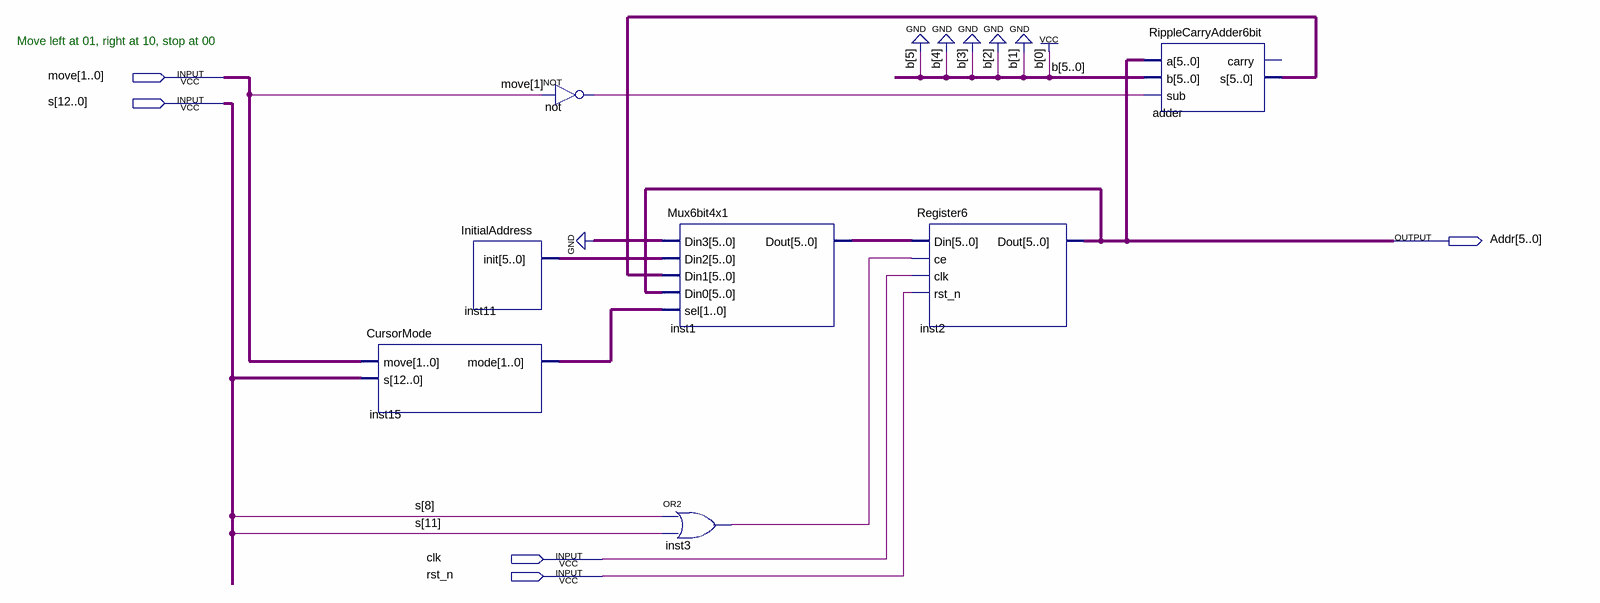
[diagram p0: schematic sheet]
// Quartus schematic Cursor.bdf as structural Verilog: 7 symbols, 5 pins
module Cursor (
  input  [1:0] move,
  input  [12:0] s,
  input  clk,
  input  rst_n,
  output [5:0] Addr
);

  wire inst3_out, not_out;
  wire [1:0] inst15_mode;
  wire [5:0] adder_s, inst1_dout, inst11_init;

  CursorMode inst15 (.move(move), .s(s), .mode(inst15_mode));
  InitialAddress inst11 (.init(inst11_init));
  not \not  (not_out, move[1]);
  Mux6bit4x1 inst1 (
    .Din3({6{1'b0}}), .Din2(inst11_init), .Din1(adder_s), .Din0(Addr), .sel(inst15_mode), .Dout(inst1_dout));
  or inst3 (inst3_out, s[8], s[11]);
  Register6 inst2 (.Din(inst1_dout), .ce(inst3_out), .clk(clk), .rst_n(rst_n), .Dout(Addr));
  RippleCarryAdder6bit adder (.a(Addr), .b(6'b000001), .sub(not_out), .s(adder_s));  // open: carry

  // Notes on the sheet:
  //   Move left at 01, right at 10, stop at 00
endmodule
